# EasyEDA schematic EasyEDA_Bench_2021-02-24.json
TITLE: Sheet_1; REV: 1.0; Date: 2021-02-23; Sheet: 1/1; Drawn By: cedric.familyq; Company: Your Company
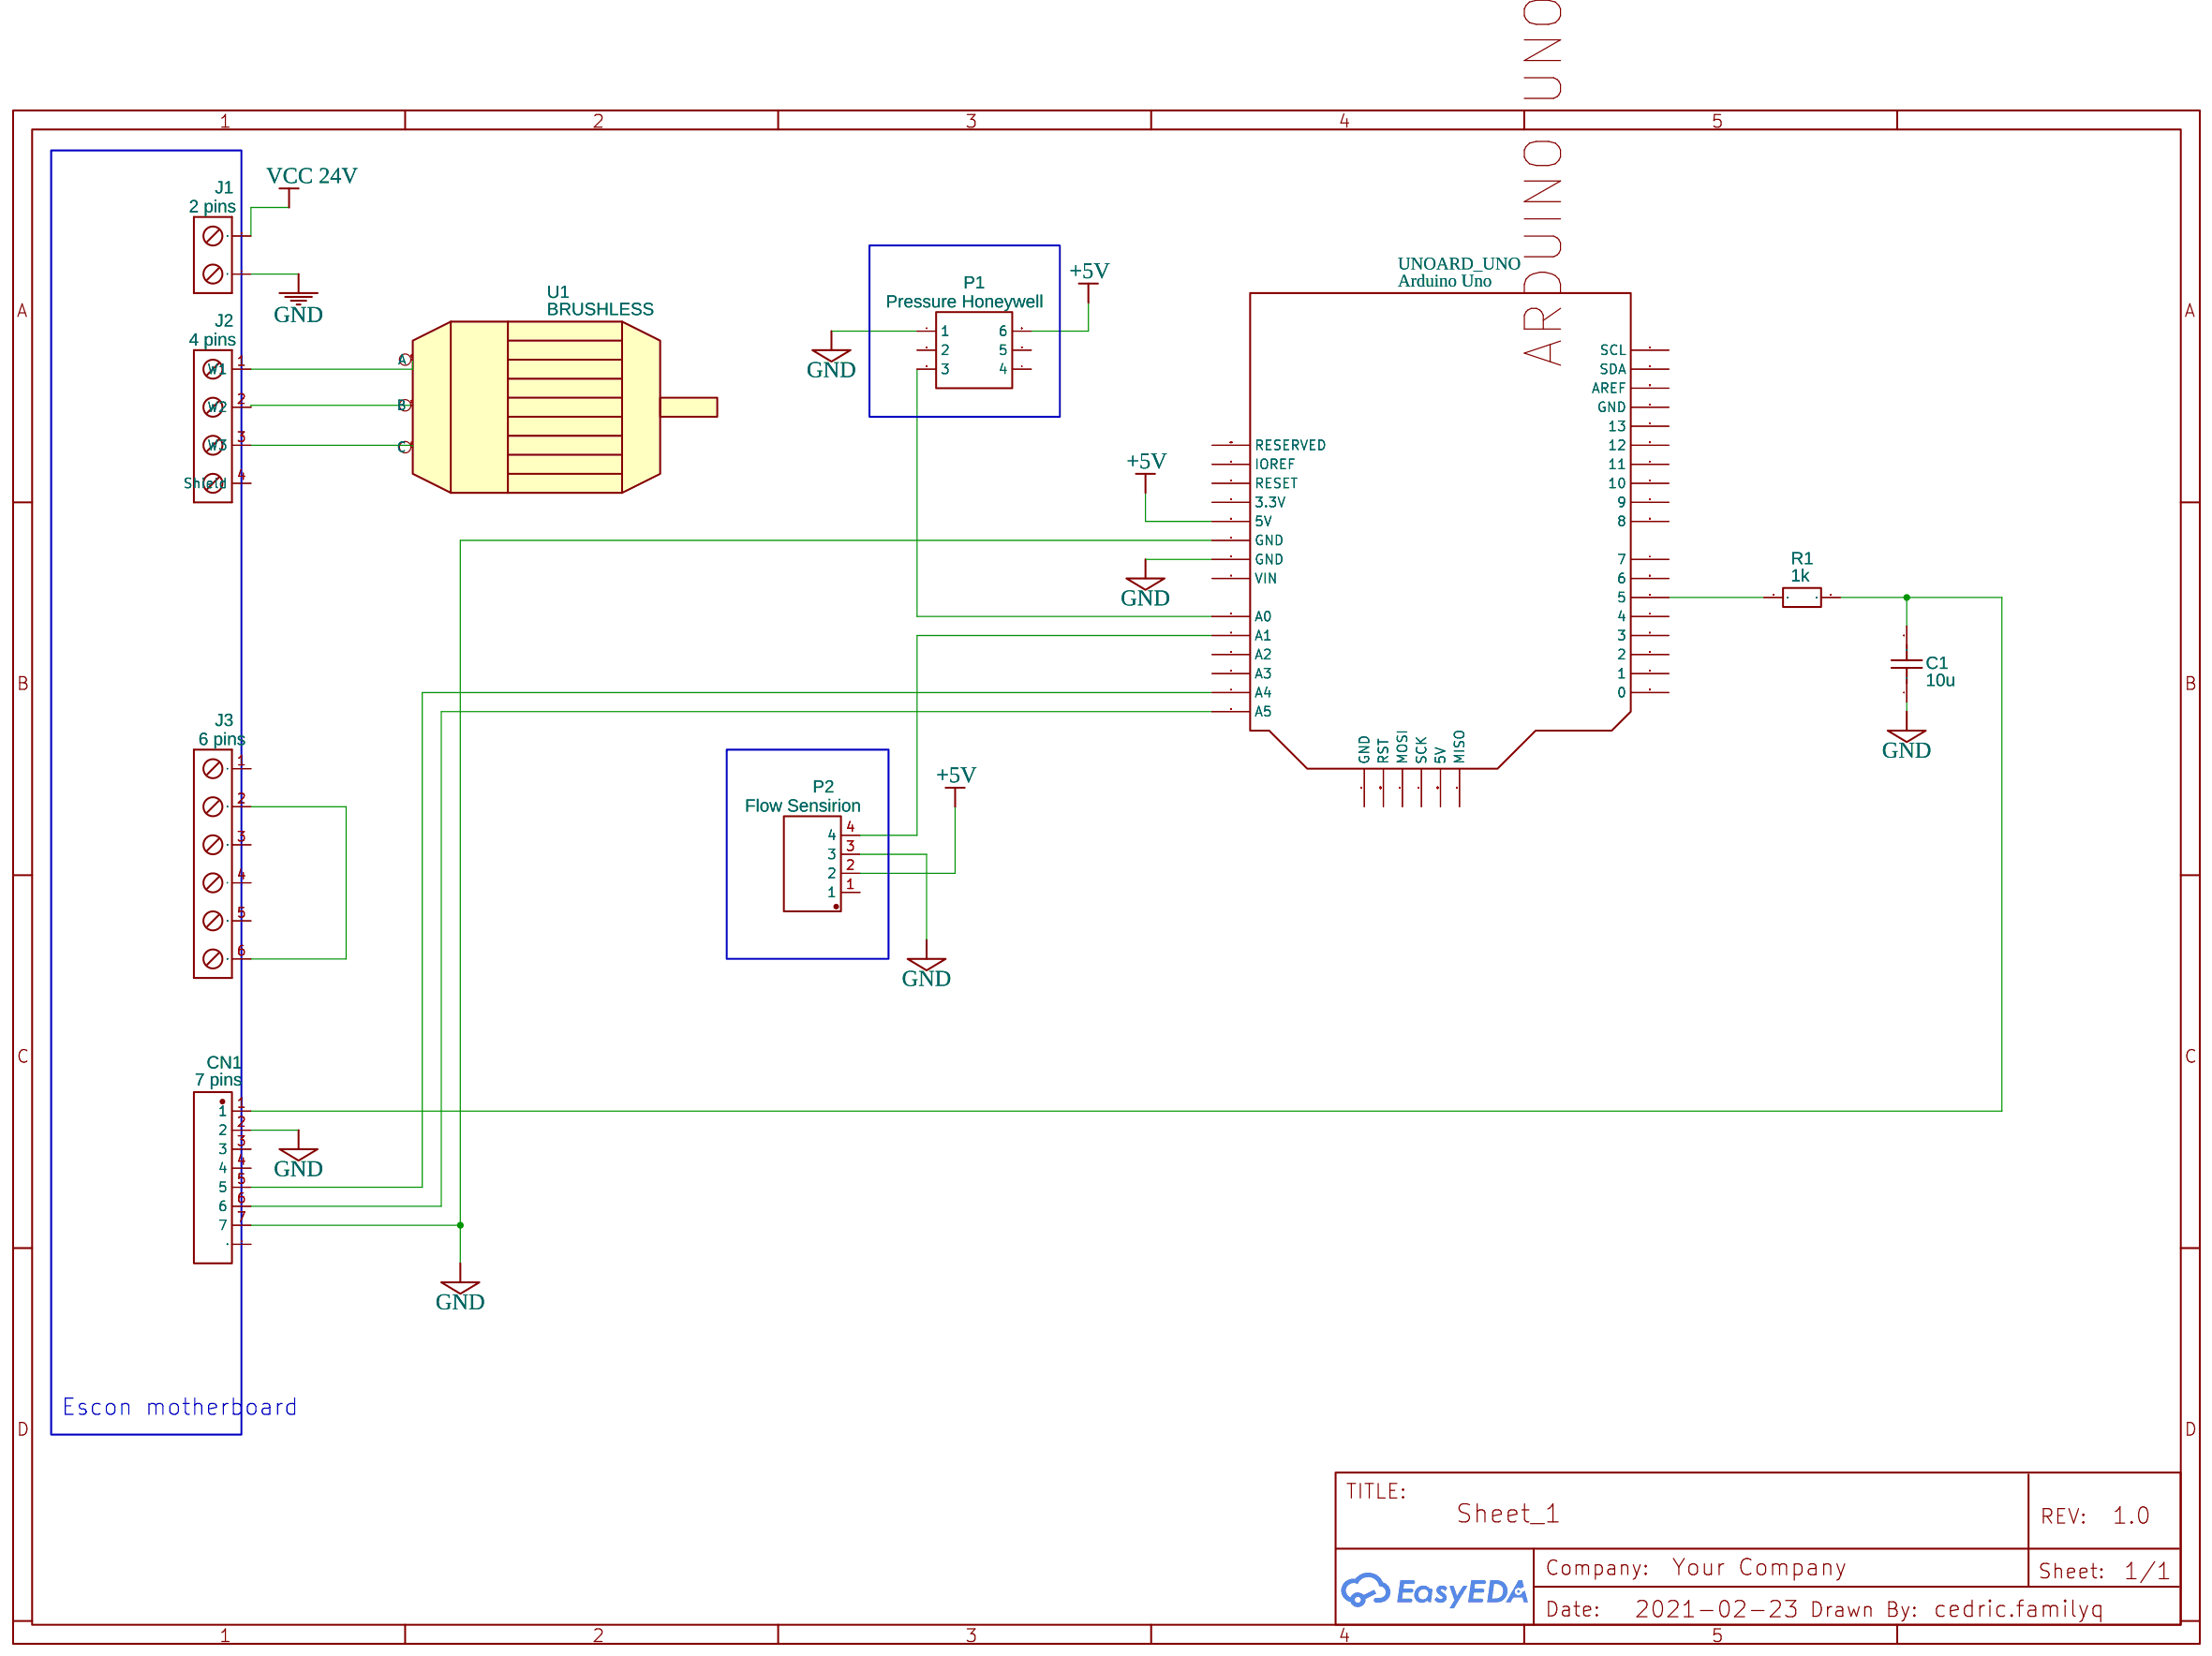
[diagram p0: schematic sheet]

## Parts
C1  10u  [C0603]
CN1  7 pins  [CONN-TH_B2541CW-8P]
J1  2 pins  [H2-5.0-10.5X8.0MM]
J2  4 pins  [BORNIER4]
J3  6 pins  [BORNIER 6]
P1  Pressure Honeywell  [IDC-TH_6P-P2.54_C11214]
P2  Flow Sensirion  [HDR-TH_4P-P2.54-V]
R1  1k  [R0603]
U1  BRUSHLESS
UNOARD_UNO  Arduino Uno

## Library data of the parts
C1 = C_0603_US: Contributor: LCEDA_Lib
CN1 = B2541CW-8P: Supplier: LCSC; Supplier Part: C339803; Manufacturer: Changjiang Connectors; Contributor: LCSC
J1 = BORNIER-VIS v2: Screw Terminal; Supplier Part: 320110031; Supplier: SeeedStudio; Manufacturer Part: ?; sourceId: 7r0AywusN
J2 = BORNIER-VIS-GREEN(4P-5.0): Screw Terminal; Supplier Part: 320110031; Supplier: SeeedStudio; Manufacturer Part: ?; sourceId: tbLIGE0mI
J3 = BORNIER-VIS-GREEN(6P-5.0): Screw Terminal; Supplier Part: 320110031; Supplier: SeeedStudio; Manufacturer Part: ?; sourceId: 61BzxheAW
P1 = HDR-IDC-2.54-2X3P: Supplier: LCSC; Manufacturer: BOOMELE; Manufacturer Part: 2X3 2.54mm IDC Box; image: //image.lceda.cn/szlcsc/C11214.jpg; Supplier Part: C11214
P2 = Header-Male-2.54_1x4_C124378: Supplier: LCSC; Manufacturer: Ckmtw; Manufacturer Part: 210S-1*4P L=11.6MMGold-plated black; Contributor: LCSC; Supplier Part: C124378; LCSC Assembly: Yes; SMT Type: Extend
R1 = R_0603_EU: Contributor: LCEDA_Lib
U1 = BRUSHLESS: Contributor: Bahattin Gok

## Nets
+5V: P1.6 P2.2 UNOARD_UNO.5V
GND: C1.1 CN1.2 CN1.7 J1.1 P1.1 P2.3 UNOARD_UNO.GND
VCC 24V: J1.2
Net-(C1-2): C1.2 CN1.1 R1.2
Net-(CN1-5): CN1.5 UNOARD_UNO.A4
Net-(CN1-6): CN1.6 UNOARD_UNO.A5
Net-(J2-1): J2.1(W1) U1.1(A)
Net-(J2-2): J2.2(W2) U1.2(B)
Net-(J2-3): J2.3(W3) U1.3(C)
Net-(J3-2): J3.2 J3.6
Net-(P1-3): P1.3 UNOARD_UNO.A0
Net-(P2-4): P2.4 UNOARD_UNO.A1
Net-(R1-1): R1.1 UNOARD_UNO.5

Not connected (* = marked no-connect by the designer): CN1 3 4 8; J2 4(Shield); J3 1 3 4 5; P1 2 4 5; P2 1; UNOARD_UNO 0 1 2 3 3.3V 4 5V_ICSP(5V) 6 7 8 9 10 11 12 13 A2 A3 AREF IOREF MISO MOSI RESERVED RESET RESET_ICSP(RST) SCK SCL SDA VIN

## Notes on the sheet
- Escon motherboard
